# Altium schematic sheet 30to50V-24V.SchDoc
size 279 x 215 mm; SheetNumber: 1; SheetTotal: 1
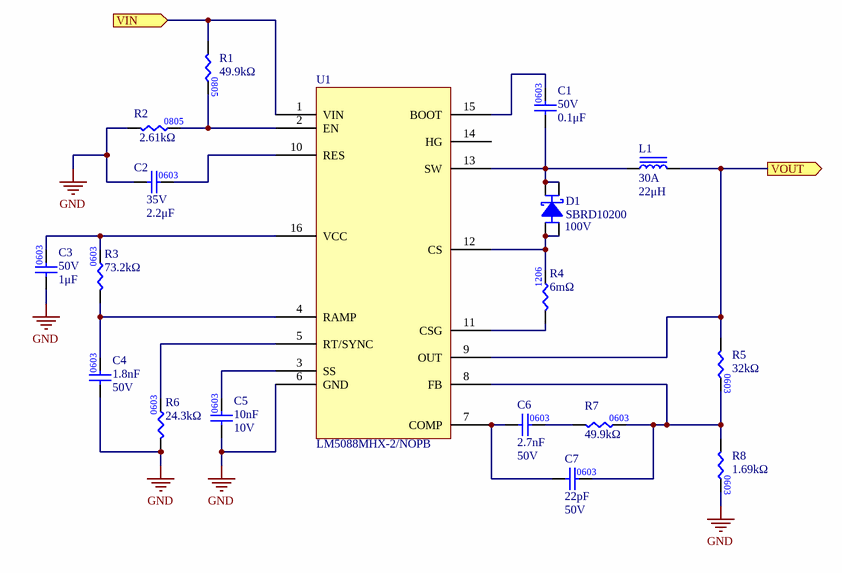
[diagram p0: 30to50V-24V.SchDoc]

## Parts
C1  value 0.1μF  Voltage Rating: 50V  [CAP0603]  (hidden comment: CAP_0.1uF_50V_0603)
C2  value 2.2μF  Voltage Rating: 35V  [CAP0603]  (hidden comment: CAP_2.2uF_35V_0603)
C3  value 1μF  Voltage Rating: 50V  [CAP0603]  (hidden comment: CAP_1uF_50V_0603)
C4  value 1.8nF  Voltage Rating: 50V  [CAP0603]  (hidden comment: CAP_1.8nF_50V_0603)
C5  value 10nF  Voltage Rating: 10V  [CAP0603]  (hidden comment: CAP_10nF_25V_0603)
C6  value 2.7nF  Voltage Rating: 50V  [CAP0603]  (hidden comment: CAP_2.7nF_50V_0603)
C7  value 22pF  Voltage Rating: 50V  [CAP0603]  (hidden comment: CAP_22pF_50V_0603)
D1  Manufacturer Part Number 1: SBRD10200  Vr (Max): 100V  [D-PAK]  (hidden comment: DIO_SCHOTTKY_100V_5.5A)
L1  Current Rating: 30A  Inductance: 22μH  [IND_VISHAY_IHLP6767GZ51]  (hidden comment: IND_22uH_30A)
R1  value 49.9kΩ  [RES0805]  (hidden comment: RES_49.9kΩ_0805_1%)
R2  value 2.61kΩ  [RES0805]  (hidden comment: RES_2.61kΩ_0805_1%)
R3  value 73.2kΩ  [RES0603]  (hidden comment: RES_73.2kΩ_0603_1%)
R4  value 6mΩ  [RES1206]  (hidden comment: RES_0.006Ω_1206_1%)
R5  value 32kΩ  [RES0603]  (hidden comment: RES_32KΩ_0603_0.1%)
R6  value 24.3kΩ  [RES0603]  (hidden comment: RES_24.3kΩ_0603_1%)
R7  value 49.9kΩ  [RES0603]  (hidden comment: RES_49.9kΩ_0603_1%)
R8  value 1.69kΩ  [RES0603]  (hidden comment: RES_1.69kΩ_0603_1%)
U1  LM5088  (value not drawn)

## Ports
VIN (in), VOUT (out)

## Nets
GND: C2.1 C3.1 C4.1 C5.1 R2.1 R6.1 R8.2 U1.6(GND)
VIN: R1.1 U1.1(VIN) ; port VIN
VOUT: L1.2 R5.1 U1.9(OUT) ; port VOUT
NetC1_1: C1.1 D1.2(Cathode) D1.4(Cathode) L1.1 U1.13(SW)
NetC1_2: C1.2 U1.15(BOOT)
NetC2_2: C2.2 U1.10(RES)
NetC3_2: C3.2 R3.2 U1.16(VCC)
NetC4_2: C4.2 R3.1 U1.4(RAMP)
NetC5_2: C5.2 U1.3(SS)
NetC6_1: C6.1 C7.1 U1.7(COMP)
NetC6_2: C6.2 R7.1
NetC7_2: C7.2 R5.2 R7.2 R8.1 U1.8(FB)
NetD1_1: D1.1(Anode) D1.3(Anode) R4.2 U1.12(CS)
NetR1_2: R1.2 R2.2 U1.2(EN)
NetR4_1: R4.1 U1.11(CSG)
NetR6_2: R6.2 U1.5(RT/SYNC)

Not connected (* = marked no-connect by the designer): U1 14(HG)

## Notes on the sheet
- University of Waterloo Robotics Team
- 200 University Ave W
- REV
- PROJECT
- Waterloo, Ontario, Canada
- N2L 3G1
- DOCUMENT
- ENGINEER
- REVIEWER
- MODIFIED
- SHEET
- OF
- (in symbol CAP_1.8nF_50V_0603) 0603
- (in symbol CAP_1uF_50V_0603) 0603
- (in symbol CAP_2.2uF_35V_0603) 0603
- (in symbol CAP_2.7nF_50V_0603) 0603
- (in symbol CAP_10nF_25V_0603) 0603
- (in symbol CAP_22pF_50V_0603) 0603
- (in symbol RES_1.69kΩ_0603_1%) 0603
- (in symbol RES_49.9kΩ_0603_1%) 0603

## Library data of the parts
C1 = CAP_0.1uF_50V_0603: CAP CER 0.1UF 50V X7R 0603; Manufacturer Part Number 1: CC0603KRX7R9BB104; Manufacturer 1: Yageo; Package/Footprint: 0603; Supplier Part Number 1: 311-1344-1-ND; Supplier 1: Digi-Key; Mounting Type: SMD; Dielectric: X7R
C2 = CAP_2.2uF_35V_0603: CAP CER 2.2UF 35V X5R 0603; Manufacturer Part Number 1: C1608X5R1V225K080AC; Manufacturer 1: TDK Corporation; Dielectric: 5; Supplier Part Number 1: 445-8025-1-ND; Supplier 1: Digi-Key
C3 = CAP_1uF_50V_0603: CAP CER 1UF 50V X6S 0603; Manufacturer Part Number 1: C1608X6S1H105K080AC; Manufacturer 1: TDK Corporation; Supplier Part Number 1: 445-7424-1-ND; Supplier 1: Digi-Key; Dielectric: X6S
C4 = CAP_1.8nF_50V_0603: CAP CER 1800PF 50V C0G/NP0 0603; Manufacturer Part Number 1: GRM1885C1H182JA01J; Manufacturer 1: Murata Electronics; Dielectric: C0G; Supplier Part Number 1: 490-6380-1-ND; Supplier 1: Digi-Key
C5 = CAP_10nF_25V_0603: CAP CER 10000PF 25V C0G 0603; Manufacturer Part Number 1: C1608C0G1E103J080AA; Manufacturer 1: Yageo; Supplier Part Number 1: 445-2664-1-ND; Supplier 1: Digi-Key; Dielectric: C0G
C6 = CAP_2.7nF_50V_0603: CAP CER 2700PF 50V X7R 0603; Manufacturer Part Number 1: GRM1885C1H272JA01D; Manufacturer 1: Murata Electronics; Dielectric: C0G; Supplier Part Number 1: 490-3283-1-ND; Supplier 1: Digi-Key
C7 = CAP_22pF_50V_0603: CAP CER 22PF 50V C0G/NPO 0603; Manufacturer Part Number 1: CC0603JRNPO9BN220; Manufacturer 1: Yageo; Dielectric: C0G; Supplier Part Number 1: 311-1062-1-ND; Supplier 1: Digi-Key
D1 = DIO_SCHOTTKY_200V_10A: DIODE SCHOTTKY 200V 10A DPAK; Manufacturer 1: SMC Diode Solutions; Package/Footprint: TO-252-3, DPak (2 Leads + Tab), SC-63; Supplier 1: Digi-Key; Supplier Part Number 1: 1655-SBRD10200CT-ND; Mounting Type: SMD
L1 = IND_22uH_30A: FIXED IND 22UH 30A 2.4 MOHM SMD; Manufacturer 1: Würth Elektronik; Manufacturer Part Number 1: 7443642200; DC Resistance (DCR): 2.4mR; Inductance Tolerance: 15%; Saturation Current: 30A; Supplier 1: Digi-Key; Supplier Part Number 1: 732-5628-ND; Mounting Type: SMD
R1 = RES_49.9kΩ_0805_1%: RES 49.9K OHM 1% 1/8W 0805; Manufacturer 1: Vishay Dale; Manufacturer Part Number 1: TNPW080549K9BEEN; Package/Footprint: 0805; Supplier 1: Digi-Key; Mounting Type: SMD; Supplier Part Number 1: 541-3802-1-ND; LCSC Part #: C17719
R2 = RES_2.61kΩ_0805_1%: RES 2.61K OHM 1% 1/8W 0805; Manufacturer 1: Vishay Dale; Manufacturer Part Number 1: RC0805FR-072K61L; Package/Footprint: 0805; Supplier 1: Digi-Key; Mounting Type: SMD; Supplier Part Number 1: 311-2.61KCRCT-ND
R3 = RES_73.2kΩ_0603_1%: RES 73.2K OHM 1% 1/10W 0603; Manufacturer 1: YAGEO; Manufacturer Part Number 1: RC0603FR-0773K2L; Power: 0.1W; Supplier Part Number 1: 311-73.2KHRCT-ND; Supplier 1: Digi-Key; Package: 0603; Tolerance: 1%
R4 = RES_0.006Ω_1206_1%: RES 0.006 OHM 1% 1W 1206; Manufacturer 1: Rohm Semiconductor; Package/Footprint: 1206; Manufacturer Part Number 1: Rohm Semiconductor; Mounting Type: SMD; Supplier 1: Digi-Key; Supplier Part Number 1: RHM.006ALCT-ND
R5 = RES_32KΩ_0603_0.1%: RES SMD 32K OHM 0.1% 1/10W 0603; Manufacturer 1: Yageo; Manufacturer Part Number 1: RT0603BRD0732KL; Supplier Part Number 1: 13-RT0603BRD0732KLCT-ND; Supplier 1: Digi-Key; Mounting Type: SMD; Package: 0603
R6 = RES_24.3kΩ_0603_1%: RES 24.3K OHM 1% 1/10W 0603; Manufacturer 1: YAGEO; Manufacturer Part Number 1: RC0603FR-0724K3L; Power: 0.1W; Supplier Part Number 1: 311-24.3KHRCT-ND; Supplier 1: Digi-Key; Package: 0603; Tolerance: 1%
R7 = RES_49.9kΩ_0603_1%: RES 49.9K OHM 1% 1/10W 0603; Manufacturer Part Number 1: RK73H1JTTD4992F; Manufacturer 1: KOA Speer Electronics, Inc.; Supplier 1: Digi-Key; Supplier Part Number 1: 2019-RK73H1JTTD4992FCT-ND; Mounting Type: SMD
R8 = RES_1.69kΩ_0603_1%: RES 1.69K OHM 1% 1/10W 0603; Manufacturer 1: Yageo; Manufacturer Part Number 1: RC0603FR-071K69L; Supplier 1: Digi-Key; Supplier Part Number 1: 311-1.69KHRCT-ND
U1 = LM5088MHX-2/NOPB: IC REG CTRLR BUCK 16HTSSOP; Manufacturer 1: Texas Instruments; Supply Voltage: 4.5V - 75V; Switching Frequency: 50kHz - 1MHz; Supplier 1: Digi-Key; Supplier Part Number 1: 296-35302-1-ND; Package: 16-HTSSOP; Manufacturer Part Number 1: LM5088MHX-2/NOPB